# Altium schematic sheet chaser.schdoc
size 307 x 218 mm; Symbol: Drawing-Symbol_A4; Device: Drawing-Symbol_A4; @Project Name: chaser; @Page Count: 1; @Update Date: 2025-12-25; @Create Date: 2025-12-24; @Schematic Name: Schematic1; @Page No: 1; @Page Name: P1; Company: EasyEDA.com; Version: V1.0; Page Size: A4; @Create Time: 21:55:45; @Update Time: 01:55:45; Width: 1170; Height: 825; Region Start: 1; X Region Count: 6; Y Region Count: 4; Blade Width: 10; Title Block Position: 3; @Board Name: Board1
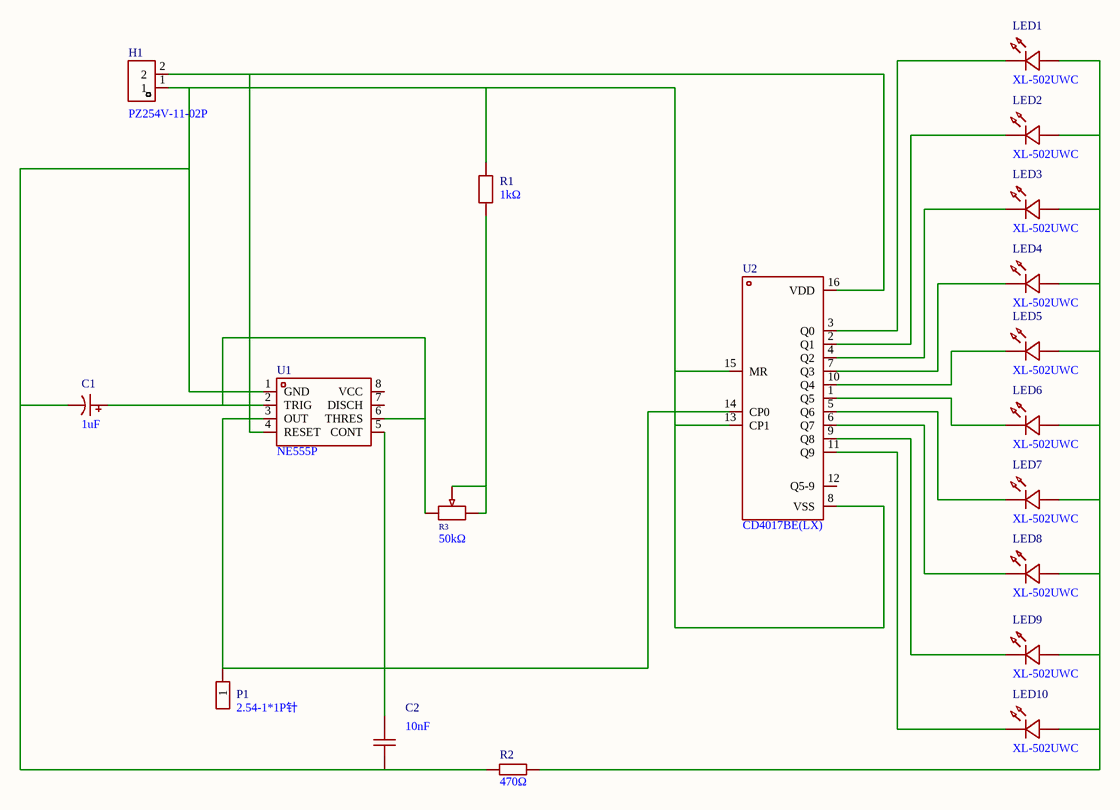
[diagram p0: chaser.schdoc]

## Parts
C1  1uF  [CAP-TH_BD5.0-P2.00-D0.8-FD]
C2  10nF  [CAP-TH_L8.0-W4.0-P5.00-D1.2]
H1  PZ254V-11-02P  [HDR-TH_2P-P2.54-V-M]
LED1  XL-502UWC  [LED-TH_BD5.9-P2.54-RD_WHITE]
LED2  XL-502UWC  [LED-TH_BD5.9-P2.54-RD_WHITE]
LED3  XL-502UWC  [LED-TH_BD5.9-P2.54-RD_WHITE]
LED4  XL-502UWC  [LED-TH_BD5.9-P2.54-RD_WHITE]
LED5  XL-502UWC  [LED-TH_BD5.9-P2.54-RD_WHITE]
LED6  XL-502UWC  [LED-TH_BD5.9-P2.54-RD_WHITE]
LED7  XL-502UWC  [LED-TH_BD5.9-P2.54-RD_WHITE]
LED8  XL-502UWC  [LED-TH_BD5.9-P2.54-RD_WHITE]
LED9  XL-502UWC  [LED-TH_BD5.9-P2.54-RD_WHITE]
LED10  XL-502UWC  [LED-TH_BD5.9-P2.54-RD_WHITE]
P1  2.54-1*1P针  [HDR-TH_1P-P2.54-V-M]
R1  1kΩ  [RES-TH_BD2.3-L6.5-P10.50-D0.5]
R2  470Ω  [RES-TH_BD2.2-L6.5-P10.50-D0.6]
R3  50kΩ  [RES-ADJ-TH_3P-L9.5-W4.85-P2.50-BL-L]
U1  NE555P  [DIP-8_L9.8-W6.6-P2.54-LS7.6-BL]
U2  CD4017BE(LX)  [PDIP-16_L19.3-W6.4-P2.54-LS7.94-BL]

## Nets
NetC1_1: C1.1 R3.1 U1.2(TRIG) U1.6(THRES)
NetC1_2: C1.2 C2.1 H1.1 R1.2 R2.1 U1.1(GND) U2.8(VSS) U2.13(CP1) U2.15(MR)
NetC2_2: C2.2 U1.5(CONT)
NetH1_2: H1.2 U1.4(RESET) U2.16(VDD)
NetLED1_1: LED1.1(K) U2.3(Q0)
NetLED1_2: LED1.2(A) LED2.2(A) LED3.2(A) LED4.2(A) LED5.2(A) LED6.2(A) LED7.2(A) LED8.2(A) LED9.2(A) LED10.2(A) R2.2
NetLED2_1: LED2.1(K) U2.2(Q1)
NetLED3_1: LED3.1(K) U2.4(Q2)
NetLED4_1: LED4.1(K) U2.7(Q3)
NetLED5_1: LED5.1(K) U2.10(Q4)
NetLED6_1: LED6.1(K) U2.1(Q5)
NetLED7_1: LED7.1(K) U2.5(Q6)
NetLED8_1: LED8.1(K) U2.6(Q7)
NetLED9_1: LED9.1(K) U2.9(Q8)
NetLED10_1: LED10.1(K) U2.11(Q9)
NetP1_1: P1.1 U1.3(OUT) U2.14(CP0)
NetR1_1: R1.1 R3.2 R3.3

Not connected (* = marked no-connect by the designer): U1 7(DISCH) 8(VCC); U2 12(Q5-9)

## Notes on the sheet
- 1
- 2
- 3
- 4
- 5
- 6
- A
- B
- C
- Schematic
- Schematic1
- Create at
- Update at
- 2025-12-24
- 2025-12-25
- Board
- Drawn
- Board1
- Page
- P1
- D
- Reviewed
- Version
- Size
- chaser
- Page  1  Total  1
- V1.0
- A4
- EasyEDA.com

## Library data of the parts
C1 = KF010M050C110A: Manufacturer: CapXon(丰宾); Add into BOM: yes; Tolerance: ±20%; Voltage Rating: 50V; Pin Spacing: 2mm; Lifetime: 2000hrs@105℃; Symbol: KF010M050C110A; Device: KF010M050C110A; LCSC Part Name: 1uF ±20% 50V; Supplier Part: C62934; Manufacturer Part: KF010M050C110A; Supplier Footprint: 插件,D5xL11mm; JLCPCB Part Class: Extended Part; Datasheet: https://item.szlcsc.com/datasheet/KF010M050C110A/63997.html; Supplier: LCSC; Convert to PCB: yes; Value: 1uF; Diameter: 5mm; Height - Seated (Max): 11mm
C2 = N09F1B103MN0B0S0N0: Manufacturer: STE(松田); Add into BOM: yes; Tolerance: ±20%; Voltage Rating: 1kV; Pin Spacing: 5mm; Temperature Coefficient: Y5V; Body Thickness: 2.5mm; Symbol: N09F1B103MN0B0S0N0; Device: N09F1B103MN0B0S0N0; LCSC Part Name: 10nF ±20% 1kV; Supplier Part: C249157; Manufacturer Part: N09F1B103MN0B0S0N0; Supplier Footprint: 插件,P=5mm; JLCPCB Part Class: Extended Part; Datasheet: https://item.szlcsc.com/datasheet/N09F1B103MN0B0S0N0/245516.html; Supplier: LCSC; Convert to PCB: yes; Value: 10nF; Diameter: 8.5mm
H1 = PZ254V-11-02P: Manufacturer: XFCN(兴飞); Add into BOM: yes; Pin Structure: 1x2P; Pitch: 2.54mm; Circluar Pins/Square Pins: Pin Header; Symbol: PZ254V-11-02P; Device: PZ254V-11-02P; LCSC Part Name: 1x2P 间距:2.54mm 方针 直插; Supplier Part: C492401; Manufacturer Part: PZ254V-11-02P; Supplier Footprint: 插件,P=2.54mm; JLCPCB Part Class: Extended Part; Datasheet: https://item.szlcsc.com/datasheet/PZ254V-11-02P/502957.html; Supplier: LCSC; Convert to PCB: yes; Row Spacing: -; Mounting Type: Through Hole; Number of Rows: 1; Number of Pins: 2P; Current Rating: -; Voltage Rating (Max): -; Length of Mating Pin: 6mm; Insulation Height: 2.5mm; Length of End Connection Pin: 3mm; Contact Material: Brass; Contact Plating: -; Operating Temperature: -40℃~+105℃; Color: Black
LED1-LED10 = XL-502UWC: Manufacturer: XINGLIGHT(成兴光); Add into BOM: yes; Lamp Holder Type: 5mm Round Lens; Illumination Color: White; Voltage - Forward(Vf): 3.3V; Power(Watts): 70mW; Forward Current: 20mA; Lens Color: Water Clear; Color Temperature: 9000K~20000K; Luminous Intensity: 20000mcd; Viewing Angle: 30°; Symbol: XL-502UWC; Device: XL-502UWC; LCSC Part Name: F5白发白短脚; Supplier Part: C2895480; Manufacturer Part: XL-502UWC; Supplier Footprint: 插件,D=5mm; JLCPCB Part Class: Extended Part; Datasheet: https://item.szlcsc.com/datasheet/XL-502UWC/3136195.html; Supplier: LCSC; Convert to PCB: yes; Mounting Style: -; Operating Temperature: -25℃~+85℃
P1 = 2.54-1*1P针: Manufacturer: BOOMELE(博穆精密); Symbol: Header-Male-2.54_1x1; Add into BOM: yes; Circluar Pins/Square Pins: Pin Header; Current Rating: 3A; Device: 2.54-1*1P针; LCSC Part Name: 方针 直插; Supplier Part: C81276; Manufacturer Part: 2.54-1*1P针; Supplier Footprint: 插件,P=2.54mm; JLCPCB Part Class: Extended Part; Datasheet: https://item.szlcsc.com/datasheet/2.54-1*1P%25E9%2592%2588/82426.html; Supplier: LCSC; Convert to PCB: yes; Pin Structure: -; Pitch: -; Row Spacing: -; Mounting Type: Through Hole; Number of Rows: 1; Number of Pins: 1P; Voltage Rating (Max): -; Length of Mating Pin: 6mm; Insulation Height: 2.5mm; Length of End Connection Pin: 3mm; Contact Material: Brass; Contact Plating: Gold; Operating Temperature: -55℃~+105℃; Color: Black
R1 = MF1/4W-1KΩ±1%T52: Manufacturer: 华星机电; Add into BOM: yes; Tolerance: ±1%; Power(Watts): 250mW; Temperature Coefficient: ±200ppm/℃; Symbol: MF1/4W-1KΩ±1%T52; Device: MF1/4W-1KΩ±1%T52; LCSC Part Name: 金属膜电阻 1kΩ ±1% 250mW; Supplier Part: C713997; Manufacturer Part: MF1/4W-1KΩ±1%T52; Supplier Footprint: 插件,D2.3xL6.5mm; JLCPCB Part Class: Extended Part; Datasheet: https://atta.szlcsc.com/upload/public/pdf/source/20200731/C713882_AE8EB1102749D7E4FB4FB13DC898C429.pdf; Supplier: LCSC; Convert to PCB: yes; Type: Metal Film Resistors; Value: 1kΩ
R2 = MFR0W4F4700A50: Manufacturer: UNI-ROYAL(厚声); Add into BOM: yes; Tolerance: ±1%; Voltage-Supply(Max): 250V; Power(Watts): 250mW; Temperature Coefficient: ±50ppm/℃; Symbol: MFR0W4F4700A50; Device: MFR0W4F4700A50; LCSC Part Name: 470Ω ±1% 250mW 金属膜电阻 铜脚，圆柱状直插; Supplier Part: C58592; Manufacturer Part: MFR0W4F4700A50; Supplier Footprint: 插件,D2.2xL6.5mm; JLCPCB Part Class: Extended Part; Datasheet: https://atta.szlcsc.com/upload/public/pdf/source/20191012/C436293_8820AA14BC71FA35E551C06C441482A0.pdf; Supplier: LCSC; Convert to PCB: yes; Type: Metal Film Resistors; Value: 470Ω
R3 = 3296X-1-503_C118912: Manufacturer: BOCHEN(博晨); Add into BOM: yes; Tolerance: ±10%; Power(Watts): 500mW; Temperature Coefficient: ±250ppm/℃; Number of Turns: 30; Symbol: 3296X-1-503_C118912; Device: 3296X-1-503_C118912; Supplier: LCSC; Supplier Part: C118912; Manufacturer Part: 3296X-1-503; Resistance: 50kΩ; JLCPCB Part Class: Extended Part; LCSC Part Name: 50kΩ ±10%; Supplier Footprint: 插件-3P,9.5x4.9mm; Datasheet: https://item.szlcsc.com/datasheet/3296X-1-503/120181.html; Convert to PCB: yes; Value: 50kΩ
U1 = NE555P: Manufacturer: TI(德州仪器); Add into BOM: yes; Symbol: NE555P; Device: NE555P; LCSC Part Name: NE555P; Supplier Part: C46749; Manufacturer Part: NE555P; Supplier Footprint: DIP-8; JLCPCB Part Class: Extended Part; Datasheet: https://www.ti.com/cn/lit/gpn/ne555; Supplier: LCSC; Convert to PCB: yes
U2 = CD4017BE(LX): Manufacturer: LX(灵星芯微); Add into BOM: yes; Logic Type: Divide-by-10; Direction: Up Counter; Voltage - Supply: 3V~15V; Number of Elements: 1; Trigger Type: Rising Edge; Reset: Asynchronous; Count Rate: 11MHz; Symbol: CD4017BE(LX); Device: CD4017BE(LX); LCSC Part Name: CD4017BE(LX); Supplier Part: C32710674; Manufacturer Part: CD4017BE(LX); Supplier Footprint: DIP-16; JLCPCB Part Class: Extended Part; Datasheet: https://atta.szlcsc.com/upload/public/pdf/source/20240723/A05E41C3796D239DF5E274CF6ACDBDA1.pdf; Supplier: LCSC; Convert to PCB: yes; Operating Temperature: -40℃~+85℃